# Altium schematic sheet Camera.SchDoc: Camera
size A3; CompanyName: CU Boulder; Organization: CU Boulder; DocumentNumber: 002; Revision: 1.1; SheetNumber: 2; SheetTotal: 8; ProjectName: PanoptiNode
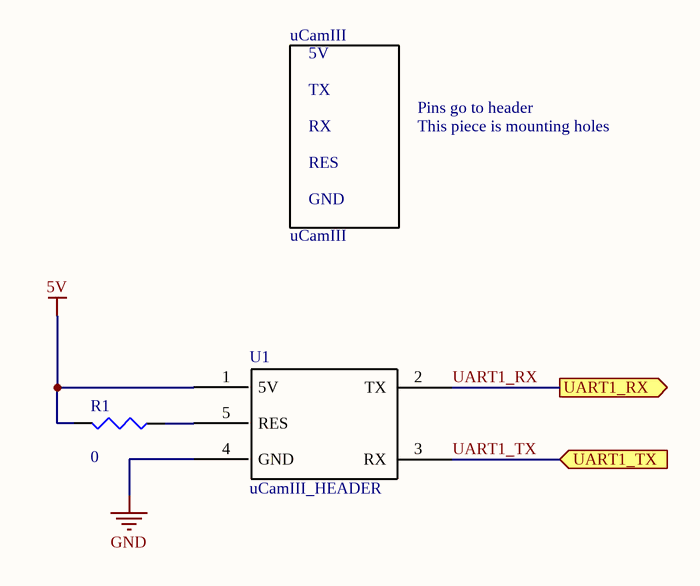
[diagram p0: Camera.SchDoc]

## Parts
R1  0  [J1-0603]
U1  uCamIII_HEADER  [uCamIII_Header]
uCamIII  uCamIII  [uCamIII]

## Ports
UART1_RX (out), UART1_TX (in)

## Nets
5V: R1.2 U1.1(5V)
GND: U1.4(GND)
UART1_RX: U1.2(TX) ; port UART1_RX
UART1_TX: U1.3(RX) ; port UART1_TX
NetR1_1: R1.1 U1.5(RES)

## Notes on the sheet
- Title
- Size:
- Date:
- A3
- Number:
- Time:
- Revision:
- Sheet
- of
- File:
- (in symbol uCamIII) 5V; TX; Pins go to header; RX; This piece is mounting holes; RES; GND

## Library data of the parts
R1 = Res3: Resistor; Published: 8-Jun-2000; LatestRevisionDate: 29-May-2009; LatestRevisionNote: IPC-7351 Footprint Added.; PackageReference: J1-0603; Publisher: Altium Limited; PackageDescription: Chip Resistor; Value: 0; Supplier 1: Digi-Key; Supplier Part Number 1: 311-0.0GRDKR-ND
U1 = uCamIII_HEADER: just a pin header for components; Supplier 1: Digi-Key; Supplier Part Number 1: 1613-1369-ND